# Altium schematic sheet Magnetometers.SchDoc: Hrafn
size Tabloid; DrawnBy: Nicholas Belsten; Organization: MIT; Address1: Route 40; Address2: Westford MA 01886; Address3: USA; DocumentNumber: 2; SheetNumber: 3; SheetTotal: 10; DCN: Aika; ProgramName: AERO-VISTA; Section: Magnetometers
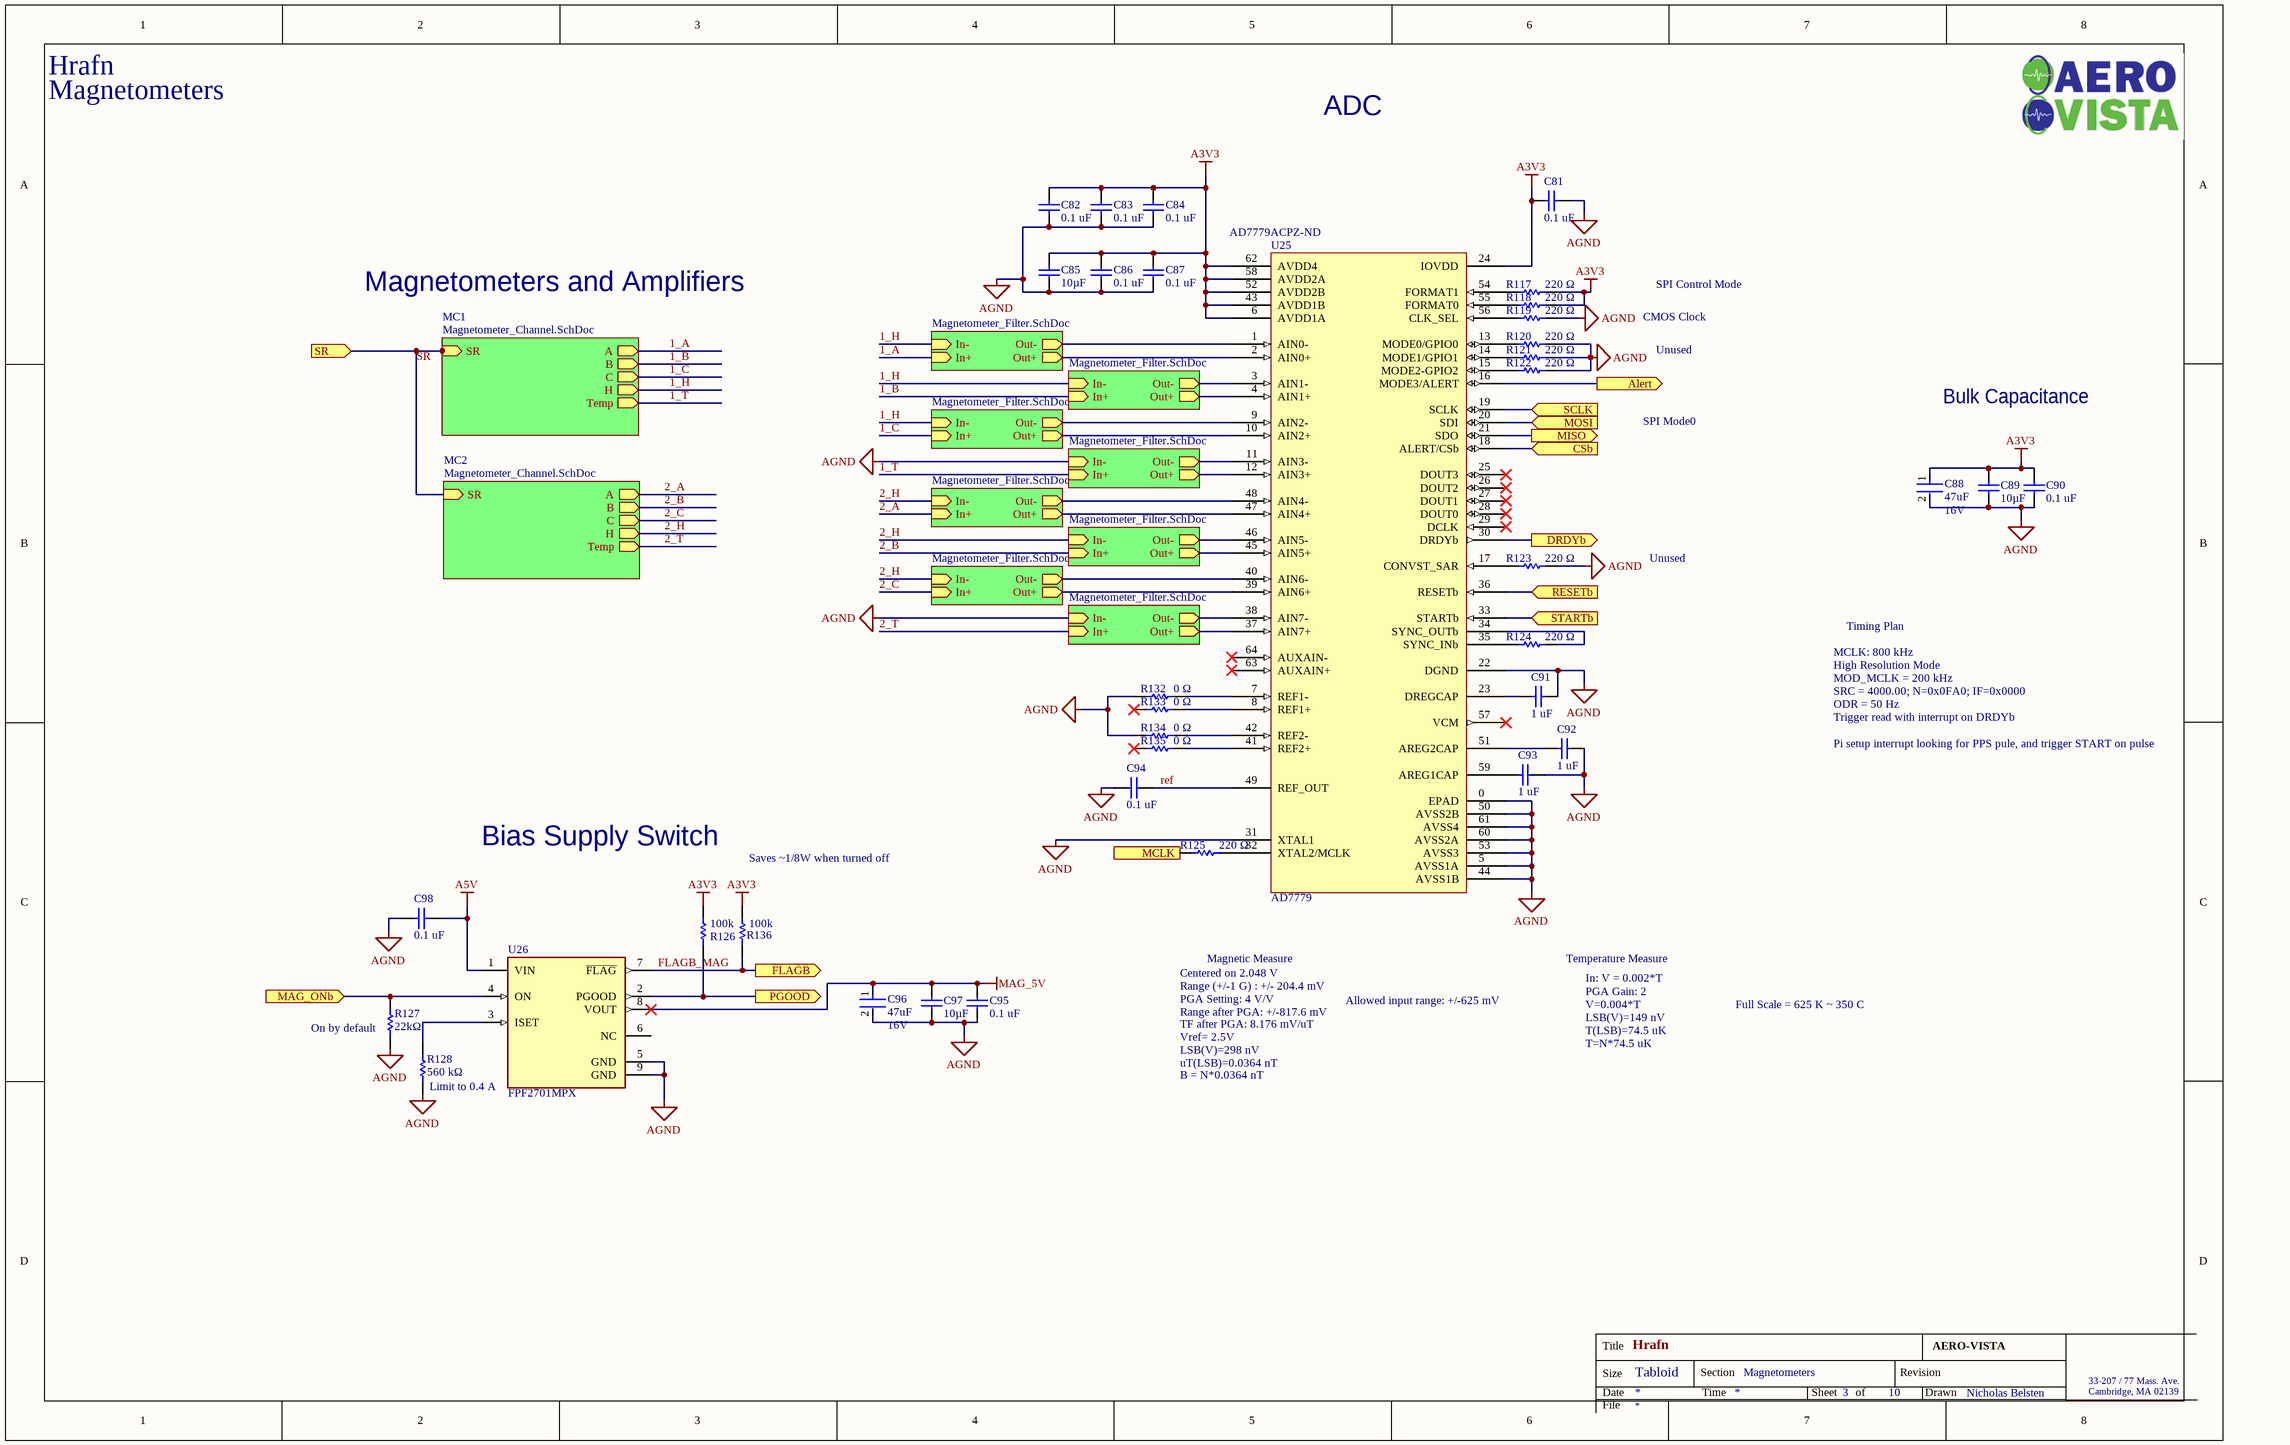
[diagram p0: Magnetometers.SchDoc]

## Parts
C81  0.1 uF  [CAPC0402(1005)60_L]
C82  0.1 uF  [CAPC0402(1005)60_L]
C83  0.1 uF  [CAPC0402(1005)60_L]
C84  0.1 uF  [CAPC0402(1005)60_L]
C85  Capacitance: 10µF  [CAPC1608X100X35LL20T25]  (hidden comment: EMK107BBJ106MA-T)
C86  0.1 uF  [CAPC0402(1005)60_L]
C87  0.1 uF  [CAPC0402(1005)60_L]
C88  Capacitance: 47uF  Voltage Rating: 16V  [FP-GRT32E-0_3-IPC_C]  (hidden comment: GRT32EC81C476ME13L)
C89  Capacitance: 10µF  [CAPC1608X100X35LL20T25]  (hidden comment: EMK107BBJ106MA-T)
C90  0.1 uF  [CAPC0402(1005)60_L]
C91  1 uF  [CAPC1005X60X30NL05T10]
C92  1 uF  [CAPC1005X60X30NL05T10]
C93  1 uF  [CAPC1005X60X30NL05T10]
C94  0.1 uF  [CAPC0402(1005)60_L]
C95  0.1 uF  [CAPC0402(1005)60_L]
C96  Capacitance: 47uF  Voltage Rating: 16V  [FP-GRT32E-0_3-IPC_C]  (hidden comment: GRT32EC81C476ME13L)
C97  Capacitance: 10µF  [CAPC1608X100X35LL20T25]  (hidden comment: EMK107BBJ106MA-T)
C98  0.1 uF  [CAPC0402(1005)60_L]
R117  220 Ω  [RESC1005X40X25LL05T05]
R118  220 Ω  [RESC1005X40X25LL05T05]
R119  220 Ω  [RESC1005X40X25LL05T05]
R120  220 Ω  [RESC1005X40X25LL05T05]
R121  220 Ω  [RESC1005X40X25LL05T05]
R122  220 Ω  [RESC1005X40X25LL05T05]
R123  220 Ω  [RESC1005X40X25NL05T05]
R124  220 Ω  [RESC1005X40X25NL05T05]
R125  220 Ω  [RESC1005X40X25LL05T05]
R126  Resistance: 100k  [RESC1005X40X25LL05T05]  (hidden comment: CRCW0402100KJNED)
R127  22kΩ  [RESC1005X40X25LL05T05]
R128  Resistance: 560 kΩ  [RESC1005X40X25LL05T05]  (hidden comment: ERJ2RKF5603X)
R132  Resistance: 0 Ω  [RESC1005X40X25LL05T05]  (hidden comment: ERJ2GE0R00X)
R133  Resistance: 0 Ω  [RESC1005X40X25LL05T05]  (hidden comment: ERJ2GE0R00X)
R134  Resistance: 0 Ω  [RESC1005X40X25LL05T05]  (hidden comment: ERJ2GE0R00X)
R135  Resistance: 0 Ω  [RESC1005X40X25LL05T05]  (hidden comment: ERJ2GE0R00X)
R136  Resistance: 100k  [RESC1005X40X25LL05T05]  (hidden comment: CRCW0402100KJNED)
U25  AD7779  Supplier Part Number 1: AD7779ACPZ-ND  [AD7779]
U26  FPF2701MPX  [FP-511DD-MFG]

## Sub-sheets
MC1 = Magnetometer_Channel.SchDoc: SR (in), A (out), B (out), C (out), H (out), Temp (out)
MC2 = Magnetometer_Channel.SchDoc: SR (in), A (out), B (out), C (out), H (out), Temp (out)
MF1 = Magnetometer_Filter.SchDoc: In+ (in), Out+ (out), In- (in), Out- (out)
MF2 = Magnetometer_Filter.SchDoc: In+ (in), Out+ (out), In- (in), Out- (out)
MF3 = Magnetometer_Filter.SchDoc: In+ (in), Out+ (out), In- (in), Out- (out)
MF4 = Magnetometer_Filter.SchDoc: In+ (in), Out+ (out), In- (in), Out- (out)
MF5 = Magnetometer_Filter.SchDoc: In+ (in), Out+ (out), In- (in), Out- (out)
MF6 = Magnetometer_Filter.SchDoc: In+ (in), Out+ (out), In- (in), Out- (out)
MF7 = Magnetometer_Filter.SchDoc: In+ (in), Out+ (out), In- (in), Out- (out)
MF8 = Magnetometer_Filter.SchDoc: In+ (in), Out+ (out), In- (in), Out- (out)

## Ports
Alert (out), CSb (in), DRDYb (out), FLAGB (out), MAG_ONb (in), MCLK (in), MISO (out), MOSI (in), PGOOD (out), RESETb (in), SCLK (in), SR (in), STARTb (in)

## Nets
A3V3: C81.2 C82.2 C83.2 C84.2 C85.2 C86.2 C87.2 C88.1 C89.2 C90.2 R117.2 R118.2 R126.2 R136.2 U25.6(AVDD1A) U25.24(IOVDD) U25.43(AVDD1B) U25.52(AVDD2B) U25.58(AVDD2A) U25.62(AVDD4)
A5V: C98.2 U26.1(VIN)
AGND: C81.1 C82.1 C83.1 C84.1 C85.1 C86.1 C87.1 C88.2 C89.1 C90.1 C91.1 C92.1 C93.1 C94.1 C95.1 C96.2 C97.1 C98.1 R119.2 R120.2 R121.2 R122.2 R123.2 R127.1 R128.1 R132.1 R134.1 U25.0(EPAD) U25.5(AVSS1A) U25.22(DGND) U25.31(XTAL1) U25.44(AVSS1B) U25.50(AVSS2B) U25.53(AVSS3) U25.60(AVSS2A) U25.61(AVSS4) U26.5(GND) U26.9(GND) ; sheet MF8/In-, sheet MF4/In-
MAG_5V: C95.2 C96.1 C97.2 U26.8(VOUT)
1_A: sheet MF1/In+, sheet MC1/A
1_B: sheet MF2/In+, sheet MC1/B
1_C: sheet MF3/In+, sheet MC1/C
1_H: sheet MF3/In-, sheet MF2/In-, sheet MF1/In-, sheet MC1/H
1_T: sheet MF4/In+, sheet MC1/Temp
2_A: sheet MF5/In+, sheet MC2/A
2_B: sheet MF6/In+, sheet MC2/B
2_C: sheet MF7/In+, sheet MC2/C
2_H: sheet MF7/In-, sheet MF6/In-, sheet MF5/In-, sheet MC2/H
2_T: sheet MF8/In+, sheet MC2/Temp
Alert: U25.16(MODE3/ALERT) ; port Alert
CSb: U25.18(ALERT/CSb) ; port CSb
DRDYb: U25.30(DRDYb) ; port DRDYb
FLAGB_MAG: R136.1 U26.7(~{FLAG}) ; port FLAGB
MAG_ONb: R127.2 U26.4(ON) ; port MAG_ONb
MCLK: R125.1 ; port MCLK
MISO: U25.21(SDO) ; port MISO
MOSI: U25.20(SDI) ; port MOSI
PGOOD: R126.1 U26.2(PGOOD) ; port PGOOD
ref: C94.2 U25.49(REF_OUT)
RESETb: U25.36(RESETb) ; port RESETb
SCLK: U25.19(SCLK) ; port SCLK
SR: port SR, sheet MC1/SR, sheet MC2/SR
STARTb: U25.33(STARTb) ; port STARTb
NetC91_2: C91.2 U25.23(DREGCAP)
NetC92_2: C92.2 U25.51(AREG2CAP)
NetC93_2: C93.2 U25.59(AREG1CAP)
NetR117_1: R117.1 U25.54(FORMAT1)
NetR118_1: R118.1 U25.55(FORMAT0)
NetR119_1: R119.1 U25.56(CLK_SEL)
NetR120_1: R120.1 U25.13(MODE0/GPIO0)
NetR121_1: R121.1 U25.14(MODE1/GPIO1)
NetR122_1: R122.1 U25.15(MODE2-GPIO2)
NetR123_1: R123.1 U25.17(CONVST_SAR)
NetR124_1: R124.1 U25.35(SYNC_INb)
NetR124_2: R124.2 U25.34(SYNC_OUTb)
NetR125_2: R125.2 U25.32(XTAL2/MCLK)
NetR128_2: R128.2 U26.3(ISET)
NetR132_2: R132.2 U25.7(REF1-)
NetR133_2: R133.2 U25.8(REF1+)
NetR134_2: R134.2 U25.42(REF2-)
NetR135_2: R135.2 U25.41(REF2+)
NetU25_1: U25.1(AIN0-) ; sheet MF1/Out-
NetU25_2: U25.2(AIN0+) ; sheet MF1/Out+
NetU25_3: U25.3(AIN1-) ; sheet MF2/Out-
NetU25_4: U25.4(AIN1+) ; sheet MF2/Out+
NetU25_9: U25.9(AIN2-) ; sheet MF3/Out-
NetU25_10: U25.10(AIN2+) ; sheet MF3/Out+
NetU25_11: U25.11(AIN3-) ; sheet MF4/Out-
NetU25_12: U25.12(AIN3+) ; sheet MF4/Out+
NetU25_37: U25.37(AIN7+) ; sheet MF8/Out+
NetU25_38: U25.38(AIN7-) ; sheet MF8/Out-
NetU25_39: U25.39(AIN6+) ; sheet MF7/Out+
NetU25_40: U25.40(AIN6-) ; sheet MF7/Out-
NetU25_45: U25.45(AIN5+) ; sheet MF6/Out+
NetU25_46: U25.46(AIN5-) ; sheet MF6/Out-
NetU25_47: U25.47(AIN4+) ; sheet MF5/Out+
NetU25_48: U25.48(AIN4-) ; sheet MF5/Out-

Not connected (* = marked no-connect by the designer): R133 1*; R135 1*; U25 25(DOUT3)* 26(DOUT2)* 27(DOUT1)* 28(DOUT0)* 29(DCLK)* 57(VCM)* 63(AUXAIN+)* 64(AUXAIN-)*; U26 6(NC)

## Notes on the sheet
- ADC
- Magnetometers and Amplifiers
- SPI Control Mode
- CMOS Clock
- Unused
- SPI Mode0
- Bulk Capacitance
- MCLK: 800 kHz
- High Resolution Mode
- MOD_MCLK = 200 kHz
- Timing Plan
- SRC = 4000.00; N=0x0FA0; IF=0x0000
- ODR = 50 Hz
- Trigger read with interrupt on DRDYb
- Pi setup interrupt looking for PPS pule, and trigger START on pulse
- Bias Supply Switch
- Saves ~1/8W when turned off
- Range (+/-1 G) : +/- 204.4 mV
- PGA Setting: 4 V/V
- Centered on 2.048 V
- Magnetic Measure
- Allowed input range: +/-625 mV
- Temperature Measure
- In: V = 0.002*T
- PGA Gain: 2
- V=0.004*T
- Full Scale = 625 K ~ 350 C
- (near R127) On by default
- Range after PGA: +/-817.6 mV
- TF after PGA: 8.176 mV/uT
- Vref= 2.5V
- LSB(V)=298 nV
- uT(LSB)=0.0364 nT
- LSB(V)=149 nV
- T(LSB)=74.5 uK
- T=N*74.5 uK
- Limit to 0.4 A
- B = N*0.0364 nT
- Title
- Size
- Date
- Tabloid
- Section
- Time
- Sheet
- of
- Revision
- Drawn
- 33-207 / 77 Mass. Ave.
- Cambridge, MA 02139
- File

## Library data of the parts
C81-C84 C86 C87 C90 C94 C95 C98 = CMP-1034-02068-1: CAP 100nF 16V ±5% 0402 (1005 Metric) Thickness 0.6mm SMD; Tolerance: Â±5%; Case-EIA: 0402; Case-Metric: 1005; Technology: SMT; Value: 100nF; Max Thickness: 0.6 mm; Rated Voltage: 16 V
C85 C89 C97 = CMP-2000-06226-1: Chip Capacitor, 10 uF, +/- 20%, 16 V, -55 to 85 degC, 0603 (1608 Metric), RoHS, Tape and Reel; Manufacturer: Taiyo Yuden; Voltage - Rated: 16V; Temperature Coefficient: X5R; Other Names: 587-3238-6; Online Catalog: MSeries; Features: -; Thickness (Max): 0.031"(0.80mm); Package / Case: 0603(1608Metric); Datasheet URL: http://www.yuden.co.jp/ut/product/category/capacitor/EMK107BBJ106MA-T.pdf; Category: Capacitors; Lead Style: -; Family: CeramicCapacitors; Package Description: 2-Pin Surface Mount Device, Body 1.70 x 0.90 mm; Tolerance: ±20%; Manufacturer URL: http://www.t-yuden.com/; Operating Temperature: -55°C~85°C; Lead Spacing: -; Height - Seated (Max): -; Series: M; Applications: GeneralPurpose; Size / Dimension: 0.063"Lx0.031"W(1.60mmx0.80mm); Standard Package: 1; Packaging: Digi-Reel®; Mounting Technology: SurfaceMount; Package Reference: 0603; Ratings: -; Datasheet Version: 10/2016; Mounting Type: SurfaceMount,MLCC
C88 C96 = CMP-06035-034903-1: Multi-Layer Ceramic Capacitor 47uF 16V X6S ±20% 1210 Emboss T/R; Ratings: AEC-Q200; Thickness: 0.106inch; Max Operating Temperature: 105°C; Width: 0.098inch; Case/Package: 1210; Length: 0.126inch; Mount: Surface Mount; Min Operating Temperature: -55°C; Tolerance: 20%; Case Code (Imperial): 1210; Case Code (Metric): 3225; Packaging: Tape and Reel
C91-C93 = CMP-2008-02056-1: Part Number: C0402C105M8PACTU; Manufacturer: Kemet; Capacitance: 1 uF
R117-R125 = CMP-2002-08356-1: Part Number: CRCW040220K0FKED; Manufacturer: Vishay Dale; Resistance: 220 Ω
R126 R136 = CMP-2002-08125-1: Manufacturer: Vishay Dale; Part Number: CRCW0402100KJNED
R127 = CMP-2002-00489-1: Manufacturer: Panasonic; Part Number: ERJ-2GEJ223X; Resistance: 22kΩ
R128 = CMP-2002-01162-1: Manufacturer: Panasonic; Part Number: ERJ2RKF5603X
R132-R135 = CMP-2000-07451-1: Chip Resistor, 0 Ohm, 0.1 W, -55 to 155 degC, 0402 (1005 Metric), RoHS, Tape and Reel; Manufacturer: Panasonic; Voltage Rating (DC): 50V; Temperature Coefficient: 600ppm/��C; Max Power Dissipation: 100mW; Tolerance: 5%; Number of Terminations: 2; Mount: SurfaceMount; Height: 0.35mm; Packaging: TapeandReel; Contact Plating: Tin; Manufacturer URL: http://www.panasonic.com/; Composition: ThickFilm; Max Operating Temperature: 155degC; REACH SVHC: NoSVHC; Case/Package: 0402; Package Reference: 402; Depth: 0.5mm; Package Description: 2-Pin Surface Mount Device, Body 1 x 0.5 mm; Datasheet URL: https://industrial.panasonic.com/cdbs/www-data/pdf/RDA0000/AOA0000C301.pdf; RoHSCompliant: True; Case Code (Imperial): 0402; Military Standard: Not; Min Operating Temperature: -55degC; Power Rating: 100mW; Datasheet Version: 03/2015; Length: 1mm; Case Code (Metric): 1005; Termination: SMD/SMT; Mounting Technology: SurfaceMount; Voltage Rating: 50V; Width: 0.02inch; Package Quantity: 1; Lead Free: LeadFree; Radiation Hardening: No
U25 = AD7779: ANALOG DEVICES - AD7779ACPZ - Analogue to Digital Converter, 8-CH, Sigma-Delta, 24 bit, 16 kSPS, Differential, Single Ended, SPI; Number of Bits: 24; Sampling Rate: 16000S/s; Interface: Serial,SPI; Number of A/D Converters: 8; Min Supply Voltage: 2.2V; Max Supply Voltage: 3.6V; Resolution: 24b; Supplier 1: Digi-Key; Manufacturer 1: Analog Devices; Manufacturer Part Number 1: AD7779ACPZ; RoHS: Yes; Category: Analog to Digital Converters (ADCs); Stock 1: 259; Pricing 1: 1=13.27000, 10=12.19800, 25=11.69200, 100=9.79600, 250=9.16400, 500=8.53200, 1000=8.40560 (USD); Number of Pins: 64; Min Operating Temperature: -40°C; Max Operating Temperature: 125°C; Packaging: Tray; Number of Inputs: 8; Lead Free: Contains Lead; REACH SVHC: No SVHC; ComponentLink1URL: http://www.mouser.com/ds/2/609/AD7779-907534.pdf?src-supplier=Mouser; ComponentLink1Description: http://www.mouser.com/ds/2/609/AD7779-907534.pdf?src-supplier=Mouser; ComponentLink2URL: http://www.farnell.com/datasheets/2251075.pdf?src-supplier=Farnell; ComponentLink2Description: http://www.farnell.com/datasheets/2251075.pdf?src-supplier=Farnell; ComponentLink3URL: http://www.farnell.com/datasheets/2170257.pdf?src-supplier=Element14; ComponentLink3Description: http://www.farnell.com/datasheets/2170257.pdf?src-supplier=Element14; ComponentLink4URL: http://www.analog.com/media/en/technical-documentation/data-sheets/AD7779.pdf?src-supplier=Digi-Key; ComponentLink4Description: http://www.analog.com/media/en/technical-documentation/data-sheets/AD7779.pdf?src-supplier=Digi-Key
U26 = CMP-07123-000004-1: IC LOAD SWITCH 0.4-2A OCP 8MLP; Manufacturer: ON Semiconductor; Turn On Delay Time: 2.7ms; Max Junction Temp: +125°C; Turn Off Delay Time: 0.1ms; Nominal Supply Current: 92uA; Number Of Outputs: 1; Max Power Dissipation: 1.25W; Rise Time: 7.5ms; Min Supply Voltage: 2.8V; Standoff Height: 0mm; Max Supply Voltage: 36V; Fall Time: 1.5ms; Device Class L3: Gate Drivers; ComponentLink2URL: https://www.onsemi.com/pub/Collateral/FPF2702-D.pdf; Temperature Range High: +125°C; Manufacturer Part Number: FPF2701MPX; Category: IC; Automotive: No; Device Class L2: Power Management ICs; Octopart: https://octopart.com/fpf2701mpx-on+semiconductor-84327806; Package: 511DD; Ambient Temperature Range Low: -40°C; Temperature: -40°C to +125°C; Height: 0.8mm; Digikey Description: IC LOAD SWITCH 0.4-2A OCP 8MLP; Device Class L1: Integrated Circuits (ICs); ComponentLink2Description: Datasheet; Mouser Description: Power Switch ICs - Power Distribution AccuPower Advanced Load Mngmnt Products; Temperature Range Low: -40°C; Ipc Land Pattern Name: DFN300X300X80-8; RoHS: TRUE; Ambient Temperature Range High: +85°C; Output Current: 0.4-2A; Lead Free: Yes; Footprint Url: https://www.onsemi.com/pub/Collateral/511DD.PDF